# EAGLE design arrbot_v0 (EAGLE 7.1.0)
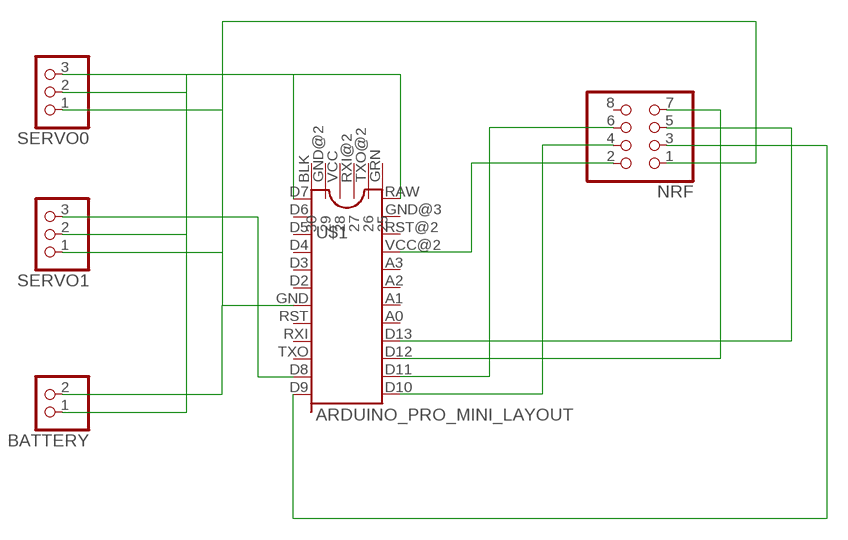
[diagram p0: schematic, sheet 1]

## Parts
BATTERY  PINHD-1X2  [1X02]
NRF  PINHD-2X4  [2X04]
SERVO0  PINHD-1X3  [1X03]
SERVO1  PINHD-1X3  [1X03]
U$1  ARDUINO_PRO_MINI_LAYOUT  [ARDUINO_PRO_MINI_PINOUT]

## Nets
N$1: BATTERY.2 NRF.1 SERVO0.1 SERVO1.1 U$1.GND
N$2: NRF.2 U$1.VCC@2
N$3: NRF.3 U$1.D9
N$4: NRF.4 U$1.D10
N$5: NRF.5 U$1.D13
N$6: NRF.6 U$1.D11
N$7: NRF.7 U$1.D12
N$8: BATTERY.1 SERVO0.2 SERVO1.2 U$1.RAW
N$9: SERVO0.3 U$1.D7
N$10: SERVO1.3 U$1.D8
Unconnected: NRF.8 U$1.A0 U$1.A1 U$1.A2 U$1.A3 U$1.BLK U$1.D2 U$1.D3 U$1.D4 U$1.D5 U$1.D6 U$1.GND@2 U$1.GND@3 U$1.GRN U$1.RST U$1.RST@2 U$1.RXI U$1.RXI@2 U$1.TXO U$1.TXO@2 U$1.VCC

## Library data of the parts
BATTERY = pinhead:PINHD-1X2: PIN HEADER
NRF = pinhead:PINHD-2X4: PIN HEADER
SERVO0 SERVO1 = pinhead:PINHD-1X3: PIN HEADER
U$1 = Jaimyns:ARDUINO_PRO_MINI_LAYOUT

## Board
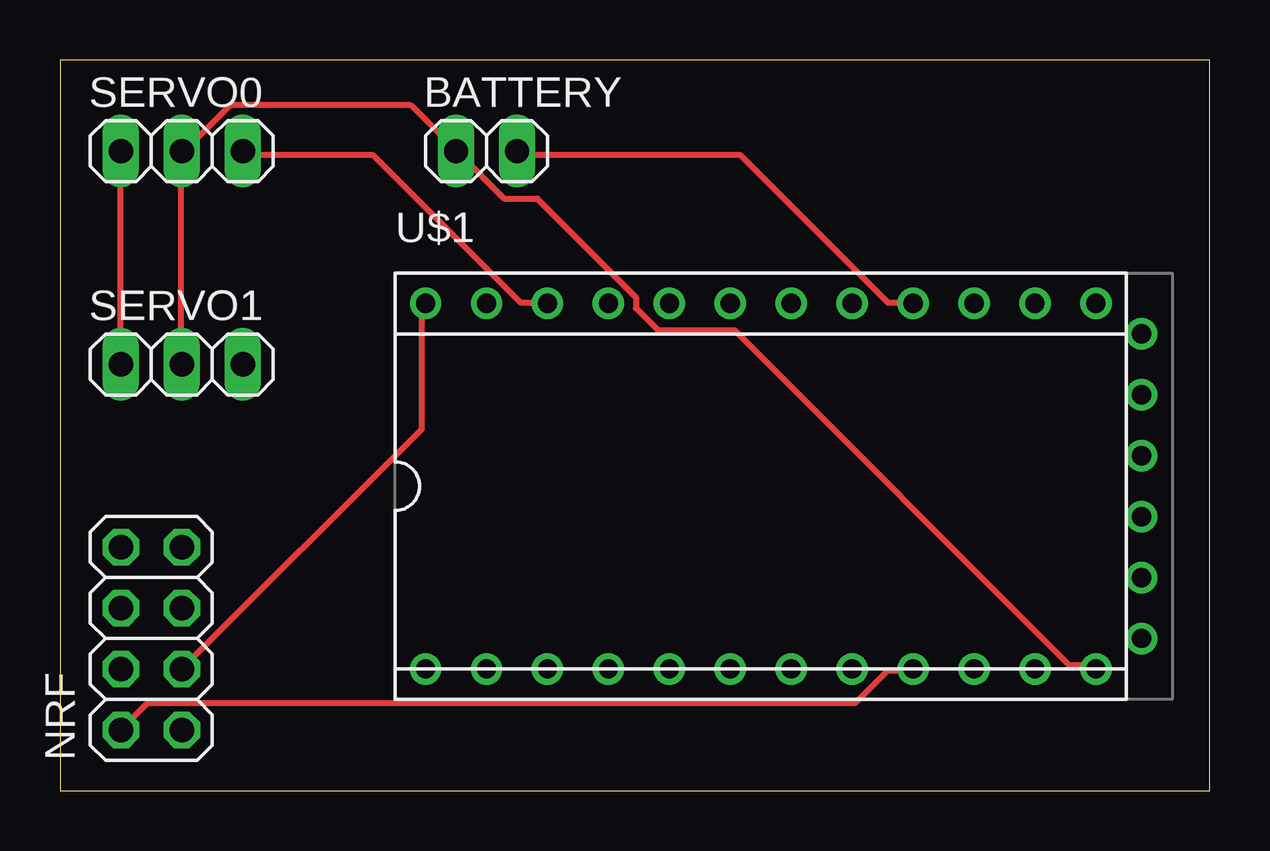
[diagram p1: board, top side]
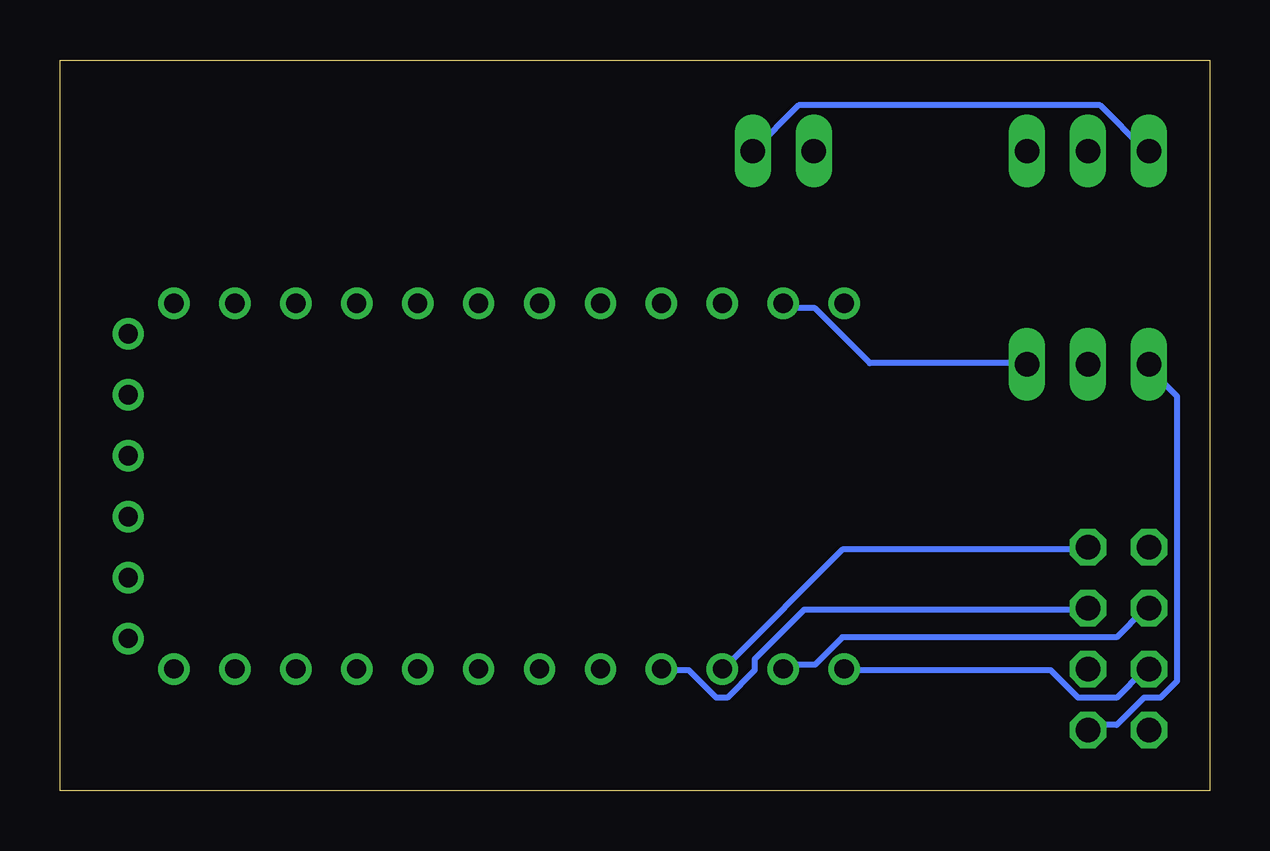
[diagram p2: board, bottom side, seen from below]

Size 47.93 x 30.47 mm. Coordinates in mm from the lower left corner, seen from the top.
Outline: 0,0 47.93,0 47.93,30.47 0,30.47 0,0
Copper layers (1*16): Top 0.035mm / dielectric 1.5mm / Bottom 0.035mm
Design rules "default": minimum track width 10mil, minimum drill 24mil, track to track 8mil, track to pad 8mil, pad to pad 8mil, via to via 8mil, smd to smd 8mil, copper to edge 40mil, drill to drill 8mil, minimum pad ring 10mil, minimum via ring 8mil, stop-mask expansion 4mil, vias tented up to drill 0mil, thermal gap 10mil

### Footprints (pad centres in the part's own frame; a part is rotated, then mirrored left to right if it is on the bottom)
1X02 = drill 1.016 long: 1 -1.27,0; 2 1.27,0
2X04 = drill 1.016 octagon: 1 -3.81,-1.27; 2 -3.81,1.27; 3 -1.27,-1.27; 4 -1.27,1.27; 5 1.27,-1.27; 6 1.27,1.27; 7 3.81,-1.27; 8 3.81,1.27
1X03 = drill 1.016 long: 1 -2.54,0; 2 0,0; 3 2.54,0
ARDUINO_PRO_MINI_PINOUT = drill 0.8: A0 -3.81,-7.62; A1 -1.27,-7.62; A2 1.27,-7.62; A3 3.81,-7.62; BLK 15.875,6.35; D2 3.81,7.62; D3 1.27,7.62; D4 -1.27,7.62; D5 -3.81,7.62; D6 -6.35,7.62; D7 -8.89,7.62; D8 -11.43,7.62; D9 -13.97,7.62; D10 -13.97,-7.62; D11 -11.43,-7.62; D12 -8.89,-7.62; D13 -6.35,-7.62; GND 6.35,7.62; GND@2 15.875,3.81; GND@3 11.43,-7.62; GRN 15.875,-6.35; RAW 13.97,-7.62; RST 8.89,7.62; RST@2 8.89,-7.62; RXI 11.43,7.62; RXI@2 15.875,-1.27; TXO 13.97,7.62; TXO@2 15.875,-3.81; VCC 15.875,1.27; VCC@2 6.35,-7.62

### Placement (x,y rotation side)
BATTERY  17.78,26.67 0 top
NRF  3.81,6.35 90 top
SERVO0  5.08,26.67 0 top
SERVO1  5.08,17.78 0 top
U$1  29.21,12.7 0 top

### Tracks (layer width: path | path; a pad name or v marks a point on that pad's centre or on a via)
N$1
  Top 0.254: U$1.GND 35.43,20.34 34.52,20.34 28.35,26.52 19.2,26.52 BATTERY.2 | SERVO1.1 2.52,17.83 2.52,26.52 SERVO0.1
  Bottom 0.254: NRF.1 5.03,2.74 3.89,2.74 2.74,3.89 2.06,3.89 1.37,4.57 1.37,16.46 2.52,17.6 SERVO1.1 | BATTERY.2 17.14,28.57 4.57,28.57 2.74,26.75 SERVO0.1
N$2
  Top 0.254: NRF.2 3.66,3.66 33.15,3.66 34.52,5.03 35.43,5.03 U$1.VCC@2
N$3
  Top 0.254: NRF.3 15.09,15.09 15.09,20.12 U$1.D9
N$4
  Bottom 0.254: U$1.D10 15.09,5.03 6.63,5.03 5.49,3.89 3.89,3.89 2.74,5.03 NRF.4
N$5
  Bottom 0.254: U$1.D13 22.86,5.03 21.72,5.03 20.57,3.89 20.12,3.89 18.97,5.03 18.97,5.49 16.92,7.54 5.26,7.54 NRF.5
N$6
  Bottom 0.254: U$1.D11 17.6,5.26 16.46,5.26 15.32,6.4 3.89,6.4 2.74,7.54 NRF.6
N$7
  Bottom 0.254: U$1.D12 20.12,5.26 15.32,10.06 5.26,10.06 NRF.7
N$8
  Top 0.254: SERVO1.2 5.03,17.83 5.03,26.52 SERVO0.2 5.26,26.75 7.09,28.57 14.63,28.57 16.46,26.75 BATTERY.1 16.69,26.52 18.52,24.69 19.89,24.69 24,20.57 24,20.12 24.92,19.2 28.12,19.2 42.06,5.26 42.98,5.26 U$1.RAW
N$9
  Top 0.254: U$1.D7 20.12,20.34 19.2,20.34 13.03,26.52 7.77,26.52 SERVO0.3
N$10
  Bottom 0.254: U$1.D8 17.6,20.12 16.46,20.12 14.17,17.83 7.77,17.83 SERVO1.3